# EAGLE design 18f4550new (EAGLE 5.11)
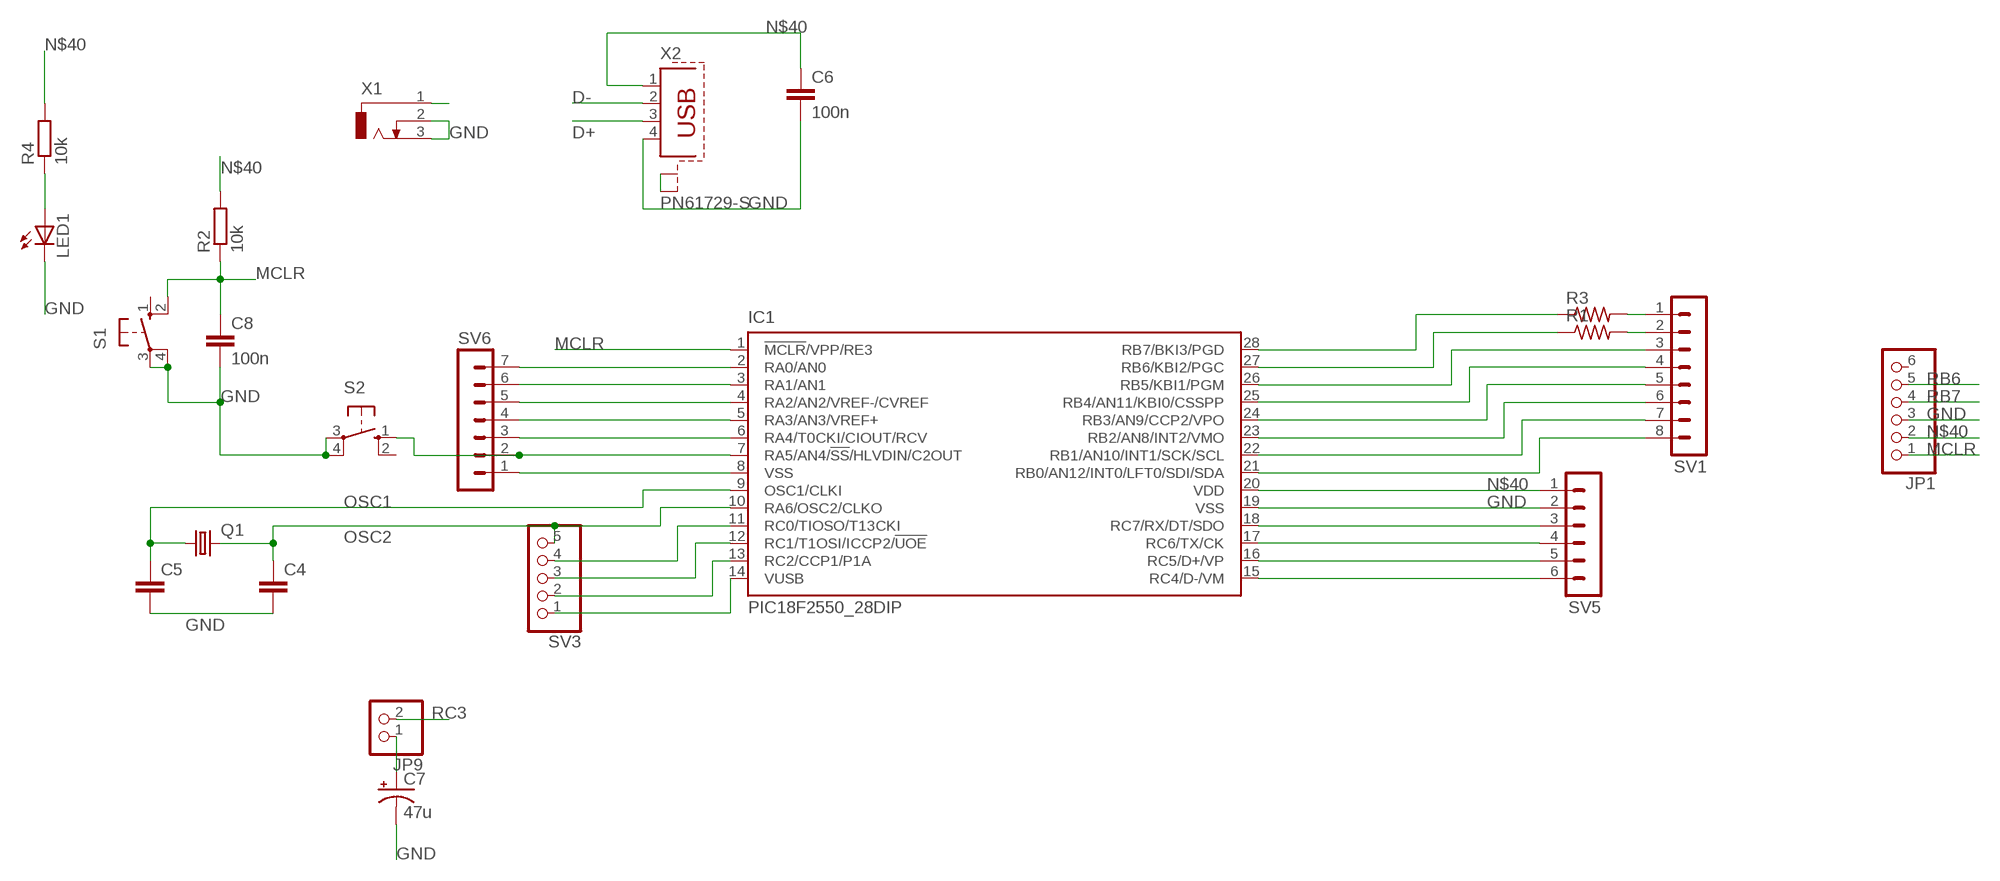
[diagram p0: schematic, sheet 1]

## Parts
C4  C-EUC0402  [C0402]
C5  C-EUC0402  [C0402]
C6  100n  C-EUC0402  [C0402]
C7  47u  CPOL-USTT2D5L  [TT2D5L]
C8  100n  C-EUC0402  [C0402]
IC1  PIC18F2550_28DIP  [DIL28-3]
JP1  PINHD-1X6  [1X06]
JP9  PINHD-1X2  [1X02]
LED1  LEDCHIP-LED0603  [CHIP-LED0603]
Q1  CRYSTALHC49S  [HC49/S]
R1  R-US_R0402  [R0402]
R2  10k  R-EU_R0402  [R0402]
R3  R-US_R0402  [R0402]
R4  10k  R-EU_R0402  [R0402]
S1  10-XX  [B3F-10XX]
S2  10-XX  [B3F-10XX]
SV1  MA08-1  [MA08-1]
SV3  PINHD-1X5  [1X05]
SV5  MA06-1  [MA06-1]
SV6  MA07-1  [MA07-1]
X1  DCJ0202  [DCJ0202]
X2  PN61729-S  [PN61729-S]

## Nets
D+: IC1.16(RC5/D+/VP) SV5.5 X2.3
D-: IC1.15(RC4/D-/VM) SV5.6 X2.2
GND: C4.2 C5.2 C6.2 C7.- C8.2 IC1.8(VSS) IC1.19(VSS) JP1.3 LED1.C S1.3(P) S1.4(P1) S2.3(P) S2.4(P1) SV5.2 SV6.1 X1.2 X1.3 X2.4 X2.S1 X2.S2
MCLR: C8.1 IC1.1(!MCLR!/VPP/RE3) JP1.1 R2.1 S1.2(S1)
N$1: R3.2 SV1.1
N$2: R1.2 SV1.2
N$3: IC1.26(RB5/KBI1/PGM) SV1.3
N$4: IC1.25(RB4/AN11/KBI0/CSSPP) SV1.4
N$5: IC1.24(RB3/AN9/CCP2/VPO) SV1.5
N$6: IC1.23(RB2/AN8/INT2/VMO) SV1.6
N$7: IC1.22(RB1/AN10/INT1/SCK/SCL) SV1.7
N$8: IC1.21(RB0/AN12/INT0/LFT0/SDI/SDA) SV1.8
N$9: IC1.18(RC7/RX/DT/SDO) SV5.3
N$10: IC1.17(RC6/TX/CK) SV5.4
N$13: IC1.2(RA0/AN0) SV6.7
N$14: IC1.3(RA1/AN1) SV6.6
N$15: IC1.4(RA2/AN2/VREF-/CVREF) SV6.5
N$16: IC1.5(RA3/AN3/VREF+) SV6.4
N$17: IC1.6(RA4/T0CKI/CIOUT/RCV) SV6.3
N$18: IC1.7(RA5/AN4/!SS!/HLVDIN/C2OUT) S2.1(S) SV6.2
N$26: IC1.11(RC0/TIOSO/T13CKI) SV3.4
N$27: IC1.12(RC1/T1OSI/ICCP2/!UOE) SV3.3
N$28: IC1.13(RC2/CCP1/P1A) SV3.2
N$39: LED1.A R4.1
N$40: C6.1 IC1.20(VDD) JP1.2 R2.2 R4.2 SV5.1 X1.1 X2.1
N$46: C7.+ JP9.1
OSC1: C5.1 IC1.9(OSC1/CLKI) Q1.1
OSC2: C4.1 IC1.10(RA6/OSC2/CLKO) Q1.2 SV3.5
RB6: IC1.27(RB6/KBI2/PGC) JP1.5 R1.1
RB7: IC1.28(RB7/BKI3/PGD) JP1.4 R3.1
RC3: IC1.14(VUSB) JP9.2 SV3.1
Unconnected: JP1.6 S1.1(S) S2.2(S1)

## Library data of the parts
C4-C6 C8 = resistor:C-EU: CAPACITOR, European symbol
C7 = rcl:CPOL-US: POLARIZED CAPACITOR, American symbol
IC1 = microchip:PIC18F2*_28: USB Microcontrollers with nanoWatt Technology High-Performance, Enhanced Flash, 28/40/44-Pin, Source: http://ww1.microchip.com/downloads/en/devicedoc/39632c.pdf; MF: MICROCHIP; MPN: PIC18F2550-I/SP; OC_FARNELL: 1523822; OC_NEWARK: 80K6054
JP1 = pinhead:PINHD-1X6: PIN HEADER
JP9 = pinhead:PINHD-1X2: PIN HEADER
LED1 = led:LED: LED OSRAM: - CHIPLED LG R971, LG N971, LY N971, LG Q971, LY Q971, LO R971, LY R971 LH N974, LH R974 LS Q976, LO Q976, LY Q976 LO Q996 - Hyper CHIPLED LW Q18S LB Q993, LB Q99A, LB R99A - SideLED LS A670, LO A670, LY A670, LG A670, LP A670 LB A673, LV A673, LT A673, LW A673 LH A674 LY A675 LS A676, LA A676, LO A676, LY A676, LW A676 LS A679, LY A679, LG A679 - Hyper Micro SIDELED® LS Y876, LA Y876, LO Y876, LY Y876 LT Y87S - SmartLED LW L88C, LW L88S LB L89C, LB L89S, LG L890 LS L89K, LO L89K, LY L89K LS L896, LA L896, LO L896, LY L896 - TOPLED LS T670, LO T670, LY T670, LG T670, LP T670 LSG T670, LSP T670, LSY T670, LOP T670, LYG T670 LG T671, LOG T671, LSG T671 LB T673, LV T673, LT T673, LW T673 LH T674 LS T676, LA T676, LO T676, LY T676, LB T676, LH T676, LSB T676, LW T676 LB T67C, LV T67C, LT T67C, LS T67K, LO T67K, LY T67K, LW E67C LS E67B, LA E67B, LO E67B, LY E67B, LB E67C, LV E67C, LT E67C LW T67C LS T679, LY T679, LG T679 LS T770, LO T770, LY T770, LG T770, LP T770 LB T773, LV T773, LT T773, LW T773 LH T774 LS E675, LA E675, LY E675, LS T675 LS T776, LA T776, LO T776, LY T776, LB T776 LHGB T686 LT T68C, LB T68C - Hyper Mini TOPLED® LB M676 - Mini TOPLED Santana® LG M470 LS M47K, LO M47K, LY M47K Source: http://www.osram.convergy.de LUXEON: - LUMILED® LXK2-PW12-R00, LXK2-PW12-S00, LXK2-PW14-U00, LXK2-PW14-V00 LXK2-PM12-R00, LXK2-PM12-S00, LXK2-PM14-U00 LXK2-PE12-Q00, LXK2-PE12-R00, LXK2-PE12-S00, LXK2-PE14-T00, LXK2-PE14-U00 LXK2-PB12-K00, LXK2-PB12-L00, LXK2-PB12-M00, LXK2-PB14-N00, LXK2-PB14-P00, LXK2-PB14-Q00 LXK2-PR12-L00, LXK2-PR12-M00, LXK2-PR14-Q00, LXK2-PR14-R00 LXK2-PD12-Q00, LXK2-PD12-R00, LXK2-PD12-S00 LXK2-PH12-R00, LXK2-PH12-S00 LXK2-PL12-P00, LXK2-PL12-Q00, LXK2-PL12-R00 Source: www.luxeon.com KINGBRIGHT: KA-3528ASYC Source: www.kingbright.com
Q1 = crystal:CRYSTAL: CRYSTAL
R1 R3 = resistor:R-US_: RESISTOR, American symbol
R2 R4 = resistor:R-EU_: RESISTOR, European symbol
S1 S2 = switch-omron:10-XX: OMRON SWITCH; MPN: B3F-1000; OC_FARNELL: 176432; OC_NEWARK: 36M3542
SV1 = con-lstb:MA08-1: PIN HEADER; OC_FARNELL: unknown; OC_NEWARK: unknown
SV3 = pinhead:PINHD-1X5: PIN HEADER
SV5 = con-lstb:MA06-1: PIN HEADER; OC_FARNELL: unknown; OC_NEWARK: unknown
SV6 = con-lstb:MA07-1: PIN HEADER; OC_FARNELL: unknown; OC_NEWARK: unknown
X1 = con-jack:DCJ0202: DC POWER JACK Source: DCJ0202.pdf; OC_FARNELL: unknown; OC_NEWARK: unknown
X2 = con-berg:PN61729-S: BERG USB connector; OC_FARNELL: unknown; OC_NEWARK: unknown

## Board
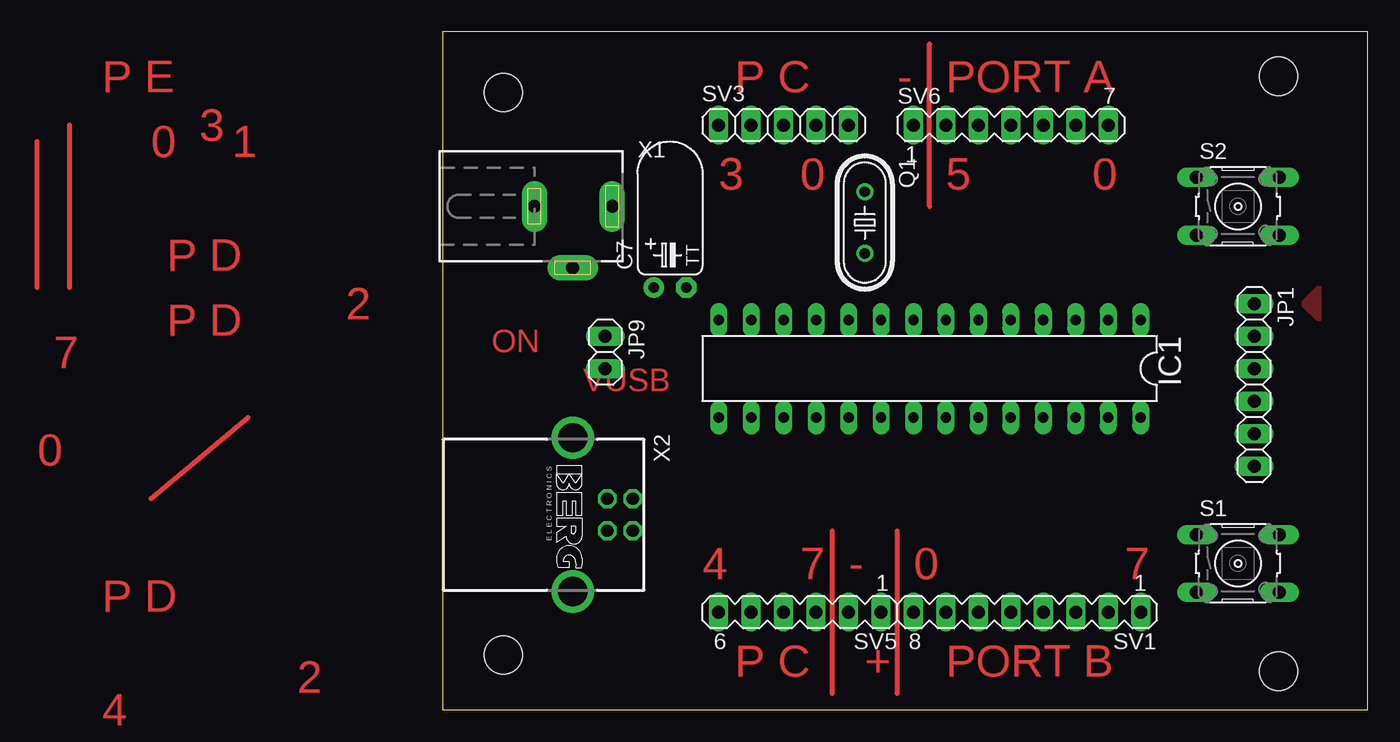
[diagram p1: board, top side]
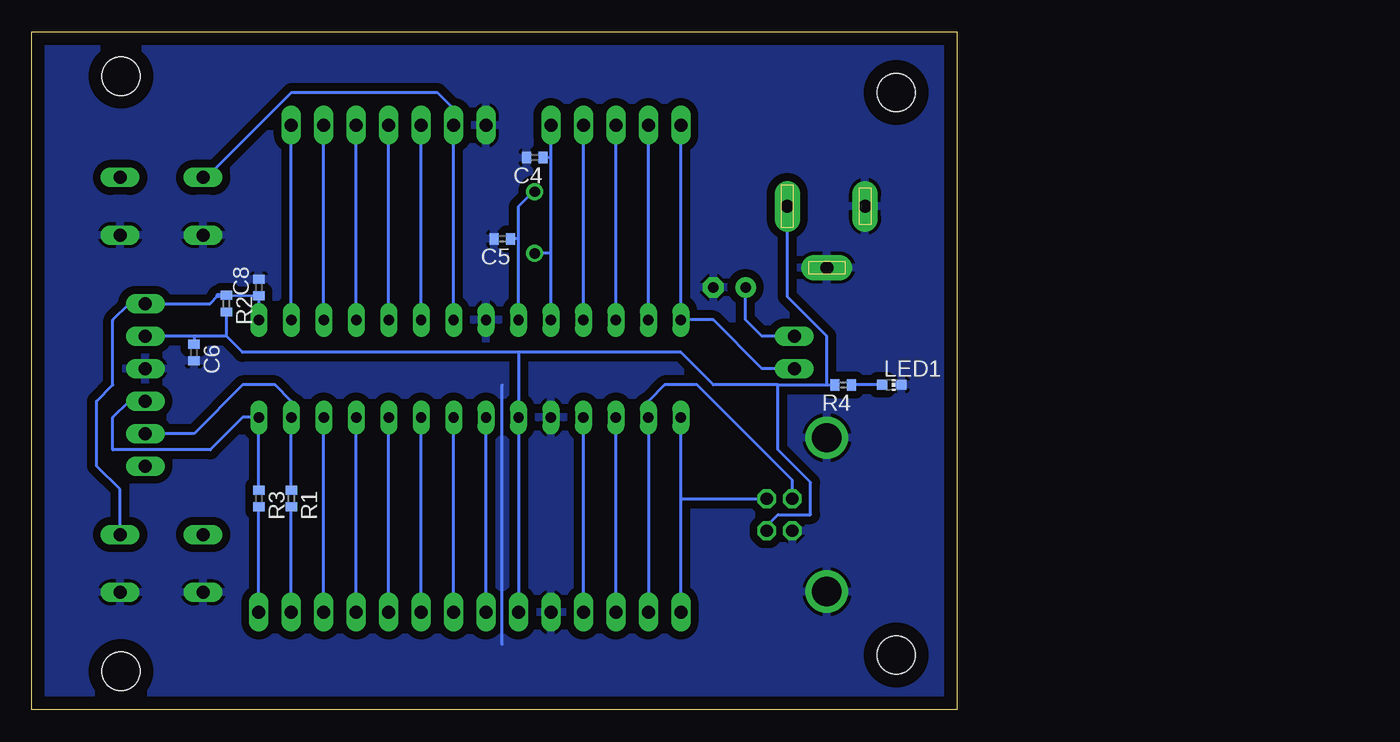
[diagram p2: board, bottom side, seen from below]

Size 72.37 x 53.01 mm. Coordinates in mm from the lower left corner, seen from the top.
Outline: 0,0 72.37,0 72.37,53.01 0,53.01 0,0
Copper layers (1*16): Top 0.035mm / dielectric 1.5mm / Bottom 0.035mm
Design rules "default": minimum track width 10mil, minimum drill 24mil, track to track 8mil, track to pad 8mil, pad to pad 8mil, via to via 8mil, smd to smd 8mil, copper to edge 40mil, drill to drill 8mil, minimum pad ring 10mil, minimum via ring 8mil, stop-mask expansion 4mil, vias tented up to drill 0mil, thermal gap 10mil
Holes 3 mm at 4.73,48.27 4.73,4.27 65.41,49.54 65.41,3

### Footprints (pad centres in the part's own frame; a part is rotated, then mirrored left to right if it is on the bottom)
C0402 = smd 0.7 x 0.9: 1 -0.65,0; 2 0.65,0
TT2D5L = drill 0.813 pad 1.6 round: + -1.27,0 | drill 0.813 pad 1.6 octagon: - 1.27,0
DIL28-3 = drill 0.813 long: 1 -16.51,-3.81; 2 -13.97,-3.81; 3 -11.43,-3.81; 4 -8.89,-3.81; 5 -6.35,-3.81; 6 -3.81,-3.81; 7 -1.27,-3.81; 8 1.27,-3.81; 9 3.81,-3.81; 10 6.35,-3.81; 11 8.89,-3.81; 12 11.43,-3.81; 13 13.97,-3.81; 14 16.51,-3.81; 15 16.51,3.81; 16 13.97,3.81; 17 11.43,3.81; 18 8.89,3.81; 19 6.35,3.81; 20 3.81,3.81; 21 1.27,3.81; 22 -1.27,3.81; 23 -3.81,3.81; 24 -6.35,3.81; 25 -8.89,3.81; 26 -11.43,3.81; 27 -13.97,3.81; 28 -16.51,3.81
1X06 = drill 1.016 long: 1 -6.35,0; 2 -3.81,0; 3 -1.27,0; 4 1.27,0; 5 3.81,0; 6 6.35,0
1X02 = drill 1.016 long: 1 -1.27,0; 2 1.27,0
CHIP-LED0603 = smd 0.8 x 0.8: A 0,-0.75; C 0,0.75
HC49/S = drill 0.813 round: 1 -2.413,0; 2 2.413,0
R0402 = smd 0.7 x 0.9: 1 -0.65,0; 2 0.65,0
B3F-10XX = drill 1.016 long: 1 -3.251,2.261; 2 3.251,2.261; 3 -3.251,-2.261; 4 3.251,-2.261
MA08-1 = drill 1.016 long: 1 -8.89,0; 2 -6.35,0; 3 -3.81,0; 4 -1.27,0; 5 1.27,0; 6 3.81,0; 7 6.35,0; 8 8.89,0
1X05 = drill 1.016 long: 1 -5.08,0; 2 -2.54,0; 3 0,0; 4 2.54,0; 5 5.08,0
MA06-1 = drill 1.016 long: 1 -6.35,0; 2 -3.81,0; 3 -1.27,0; 4 1.27,0; 5 3.81,0; 6 6.35,0
MA07-1 = drill 1.016 long: 1 -7.62,0; 2 -5.08,0; 3 -2.54,0; 4 0,0; 5 2.54,0; 6 5.08,0; 7 7.62,0
DCJ0202 = drill 1 pad 2 long: 1 0,3.1; 2 4.8,0; 3 0,-3
PN61729-S = drill 0.95 octagon: 1 1.25,4.71; 2 -1.25,4.71; 3 -1.25,2.71; 4 1.25,2.71 | drill 2.3 pad 2.9 round: S1 -6.02,0; S2 6.02,0

### Placement (x,y rotation side)
C4  33.02,43.18 180 bottom
C5  35.56,36.83 180 bottom
C6  59.69,27.94 270 bottom
C7  17.78,33.02 0 top
C8  54.61,33.02 90 bottom
IC1  38.1,26.67 180 top
JP1  63.5,25.4 270 top
JP9  12.7,27.94 270 top
LED1  5.08,25.4 270 bottom
Q1  33.02,38.1 270 top
R1  52.07,16.51 270 bottom
R2  57.15,31.75 270 bottom
R3  54.61,16.51 270 bottom
R4  8.89,25.4 180 bottom
S1  62.23,11.43 0 top
S2  62.23,39.37 0 top
SV1  45.72,7.62 180 top
SV3  26.67,45.72 0 top
SV5  27.94,7.62 180 top
SV6  44.45,45.72 0 top
X1  10.16,39.37 270 top
X2  10.16,15.24 270 top

### Tracks (layer width: path | path; a pad name or v marks a point on that pad's centre or on a via)
D+
  Bottom 0.254: X2.3 12.87,17.95 20.32,25.4 22.86,25.4 24.13,24.13 IC1.16 SV5.5
D-
  Bottom 0.254: SV5.6 21.59,16.51 | 21.59,16.51 IC1.15 | X2.2 21.57,16.49 21.59,16.51
GND
  Bottom 0.254: 35.56,5.08 35.56,25.4
  pour Bottom (isolate 0.61): 0,53.34 0,0 72.39,0 72.39,53.34
MCLR
  Bottom 0.254: R2.1 C8.1 IC1.1 | 57.8,32.4 58.42,31.75 JP1.1 64.77,31.75 66.04,30.48 66.04,25.4 67.31,24.13 67.31,19.05 65.48,17.22 S1.2
  Bottom 0.406: 57.8,32.4 R2.1
N$1
  Bottom 0.254: SV1.1 R3.2
N$2
  Bottom 0.254: SV1.2 R1.2
N$3
  Bottom 0.254: SV1.3 IC1.26
N$4
  Bottom 0.254: SV1.4 IC1.25
N$5
  Bottom 0.254: SV1.5 IC1.24
N$6
  Bottom 0.254: SV1.6 IC1.23
N$7
  Bottom 0.254: SV1.7 IC1.22
N$8
  Bottom 0.254: SV1.8 IC1.21
N$9
  Bottom 0.254: SV5.3 IC1.18
N$10
  Bottom 0.254: SV5.4 IC1.17
N$13
  Bottom 0.254: IC1.2 SV6.7
N$14
  Bottom 0.254: IC1.3 SV6.6
N$15
  Bottom 0.254: IC1.4 SV6.5
N$16
  Bottom 0.254: IC1.5 SV6.4
N$17
  Bottom 0.254: IC1.6 SV6.3
N$18
  Bottom 0.254: IC1.7 SV6.2 39.37,46.99 40.64,48.26 52.07,48.26 58.42,41.91 58.7,41.91 S2.1
N$22
  Top 0.406: 30.48,1.27 30.48,13.97
N$23
  pour Top: 67.31,31.75 68.58,30.48 68.58,33.02
N$26
  Bottom 0.254: IC1.11 SV3.4
N$27
  Bottom 0.254: IC1.12 SV3.3
N$28
  Bottom 0.254: IC1.13 SV3.2
N$29
  Top 0.406: -29.21,33.02 -29.21,45.72
N$34
  Top 0.406: 38.1,39.37 38.1,52.07
N$35
  Top 0.406: -31.75,33.02 -31.75,44.45
N$36
  Top 0.406: -22.86,16.51 -15.24,22.86
N$38
  Top 0.406: 35.56,1.27 35.56,13.97
N$39
  Bottom 0.254: LED1.A R4.1
N$40
  Bottom 0.254: X2.1 14.87,14.34 13.97,15.24 11.43,15.24 11.43,17.78 13.97,20.32 13.97,25.4 | 13.97,25.4 19.05,25.4 21.59,27.94 34.29,27.94 | 13.97,25.4 10.16,25.4 | 10.16,25.4 R4.2 | X1.1 13.26,32.31 10.16,29.21 10.16,25.4 | 34.29,27.94 55.88,27.94 57.15,29.21 | 57.15,29.21 59.69,29.21 | 59.69,29.21 JP1.2 | 59.69,29.21 C6.1 | 57.15,29.21 R2.2 | SV5.1 IC1.20 34.29,27.94
N$46
  Bottom 0.254: C7.+ 16.51,30.48 15.24,29.21 JP9.1
OSC1
  Bottom 0.254: Q1.1 33.02,40.64 34.29,39.37 34.29,36.83 | IC1.9 34.29,36.83 | 34.29,36.83 C5.1
OSC2
  Bottom 0.254: 31.75,35.69 Q1.2 | IC1.10 31.75,35.69 | 31.75,35.69 31.75,43.18 | 31.75,43.18 SV3.5 | 31.75,43.18 C4.1
  Bottom 0.406: Q1.2 32.89,35.56
RB6
  Bottom 0.254: JP1.5 59.69,21.59 55.88,25.4 53.34,25.4 52.07,24.13 IC1.27 R1.1
RB7
  Bottom 0.254: JP1.4 64.77,24.13 66.04,22.86 66.04,20.32 58.42,20.32 55.88,22.86 IC1.28 R3.1
RC3
  Bottom 0.254: JP9.2 15.24,26.67 19.05,30.48 IC1.14 SV3.1

### Text on the board
Top: P E | P C | - | PORT A | 3 | 0 | 1 | 3 | 0 | 5 | 0 | P D | 2 | P D | ON | 7 | VUSB | 0 | + | 4 | 7 | - | 0 | 7 | P D | P C | + | PORT B | 2 | 4